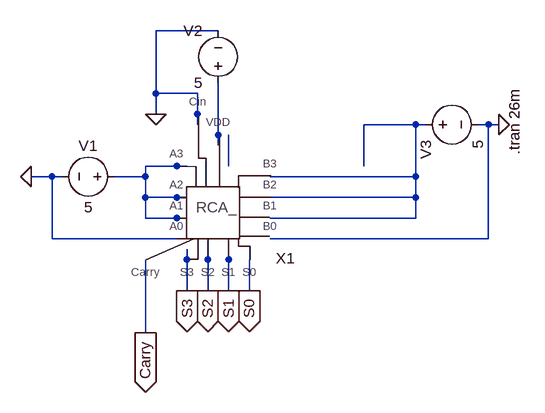
[diagram p0: schematic RCA_fulladder_component.asc]
RCA_fulladder_component.asc, the LTspice schematic file:
Version 4
SHEET 1 880 680
WIRE 144 -80 48 -80
WIRE 48 16 48 -80
WIRE 112 16 48 16
WIRE 48 48 48 16
WIRE 112 48 112 16
WIRE 112 64 112 48
WIRE 448 64 368 64
WIRE 464 64 448 64
WIRE 560 64 544 64
WIRE 576 64 560 64
WIRE 144 80 144 0
WIRE 144 96 144 80
WIRE 80 128 32 128
WIRE 96 128 80 128
WIRE 160 128 160 80
WIRE 368 128 368 64
WIRE -112 144 -144 144
WIRE -96 144 -112 144
WIRE 32 144 32 128
WIRE 32 144 -16 144
WIRE 448 144 448 64
WIRE 448 144 224 144
WIRE 32 176 32 144
WIRE 80 176 32 176
WIRE 96 176 80 176
WIRE 448 176 448 144
WIRE 448 176 224 176
WIRE 32 208 32 176
WIRE 80 208 32 208
WIRE 96 208 80 208
WIRE 448 208 448 176
WIRE 448 208 224 208
WIRE -112 240 -112 144
WIRE 80 240 -112 240
WIRE 560 240 560 64
WIRE 560 240 224 240
WIRE 96 272 96 256
WIRE 128 272 128 240
WIRE 160 272 160 240
WIRE 96 320 96 272
WIRE 128 320 128 272
WIRE 160 320 160 272
WIRE 192 320 192 272
WIRE 32 384 32 272
FLAG 96 320 S3
IOPIN 96 320 Out
FLAG 128 320 S2
IOPIN 128 320 Out
FLAG 160 320 S1
IOPIN 160 320 Out
FLAG 192 320 S0
IOPIN 192 320 Out
FLAG 32 384 Carry
IOPIN 32 384 Out
FLAG 48 48 0
FLAG 576 64 0
FLAG -144 144 0
SYMBOL RCA_ 128 240 R0
SYMATTR InstName X1
SYMBOL voltage 144 16 R180
WINDOW 0 24 96 Left 2
WINDOW 3 24 16 Left 2
WINDOW 123 0 0 Left 2
WINDOW 39 0 0 Left 2
SYMATTR InstName V2
SYMATTR Value 5
SYMBOL voltage 448 64 M90
WINDOW 123 0 0 Left 2
WINDOW 39 0 0 Left 2
SYMATTR InstName V3
SYMATTR Value 5
SYMBOL voltage 0 144 M270
WINDOW 0 32 56 VTop 2
WINDOW 3 -32 56 VBottom 2
WINDOW 123 0 0 Left 2
WINDOW 39 0 0 Left 2
SYMATTR InstName V1
SYMATTR Value 5
TEXT 600 8 VRight 2 !.tran 26m

The netlist it stands for:
* RCA_fulladder_component.asc
XX1 N003 N003 N003 0 S3 S2 S1 S0 Carry N001 N001 N002 N001 0 0 RCA_  ; pins A3 A2 A1 A0 S3 S2 S1 S0 Carry B3 B2 VDD B1 B0 Cin
V2 N002 0 5
V3 N001 0 5
V1 N003 0 5
.tran 26m
.backanno
.end